# EAGLE design feelerBox1 (EAGLE 7.2.0)
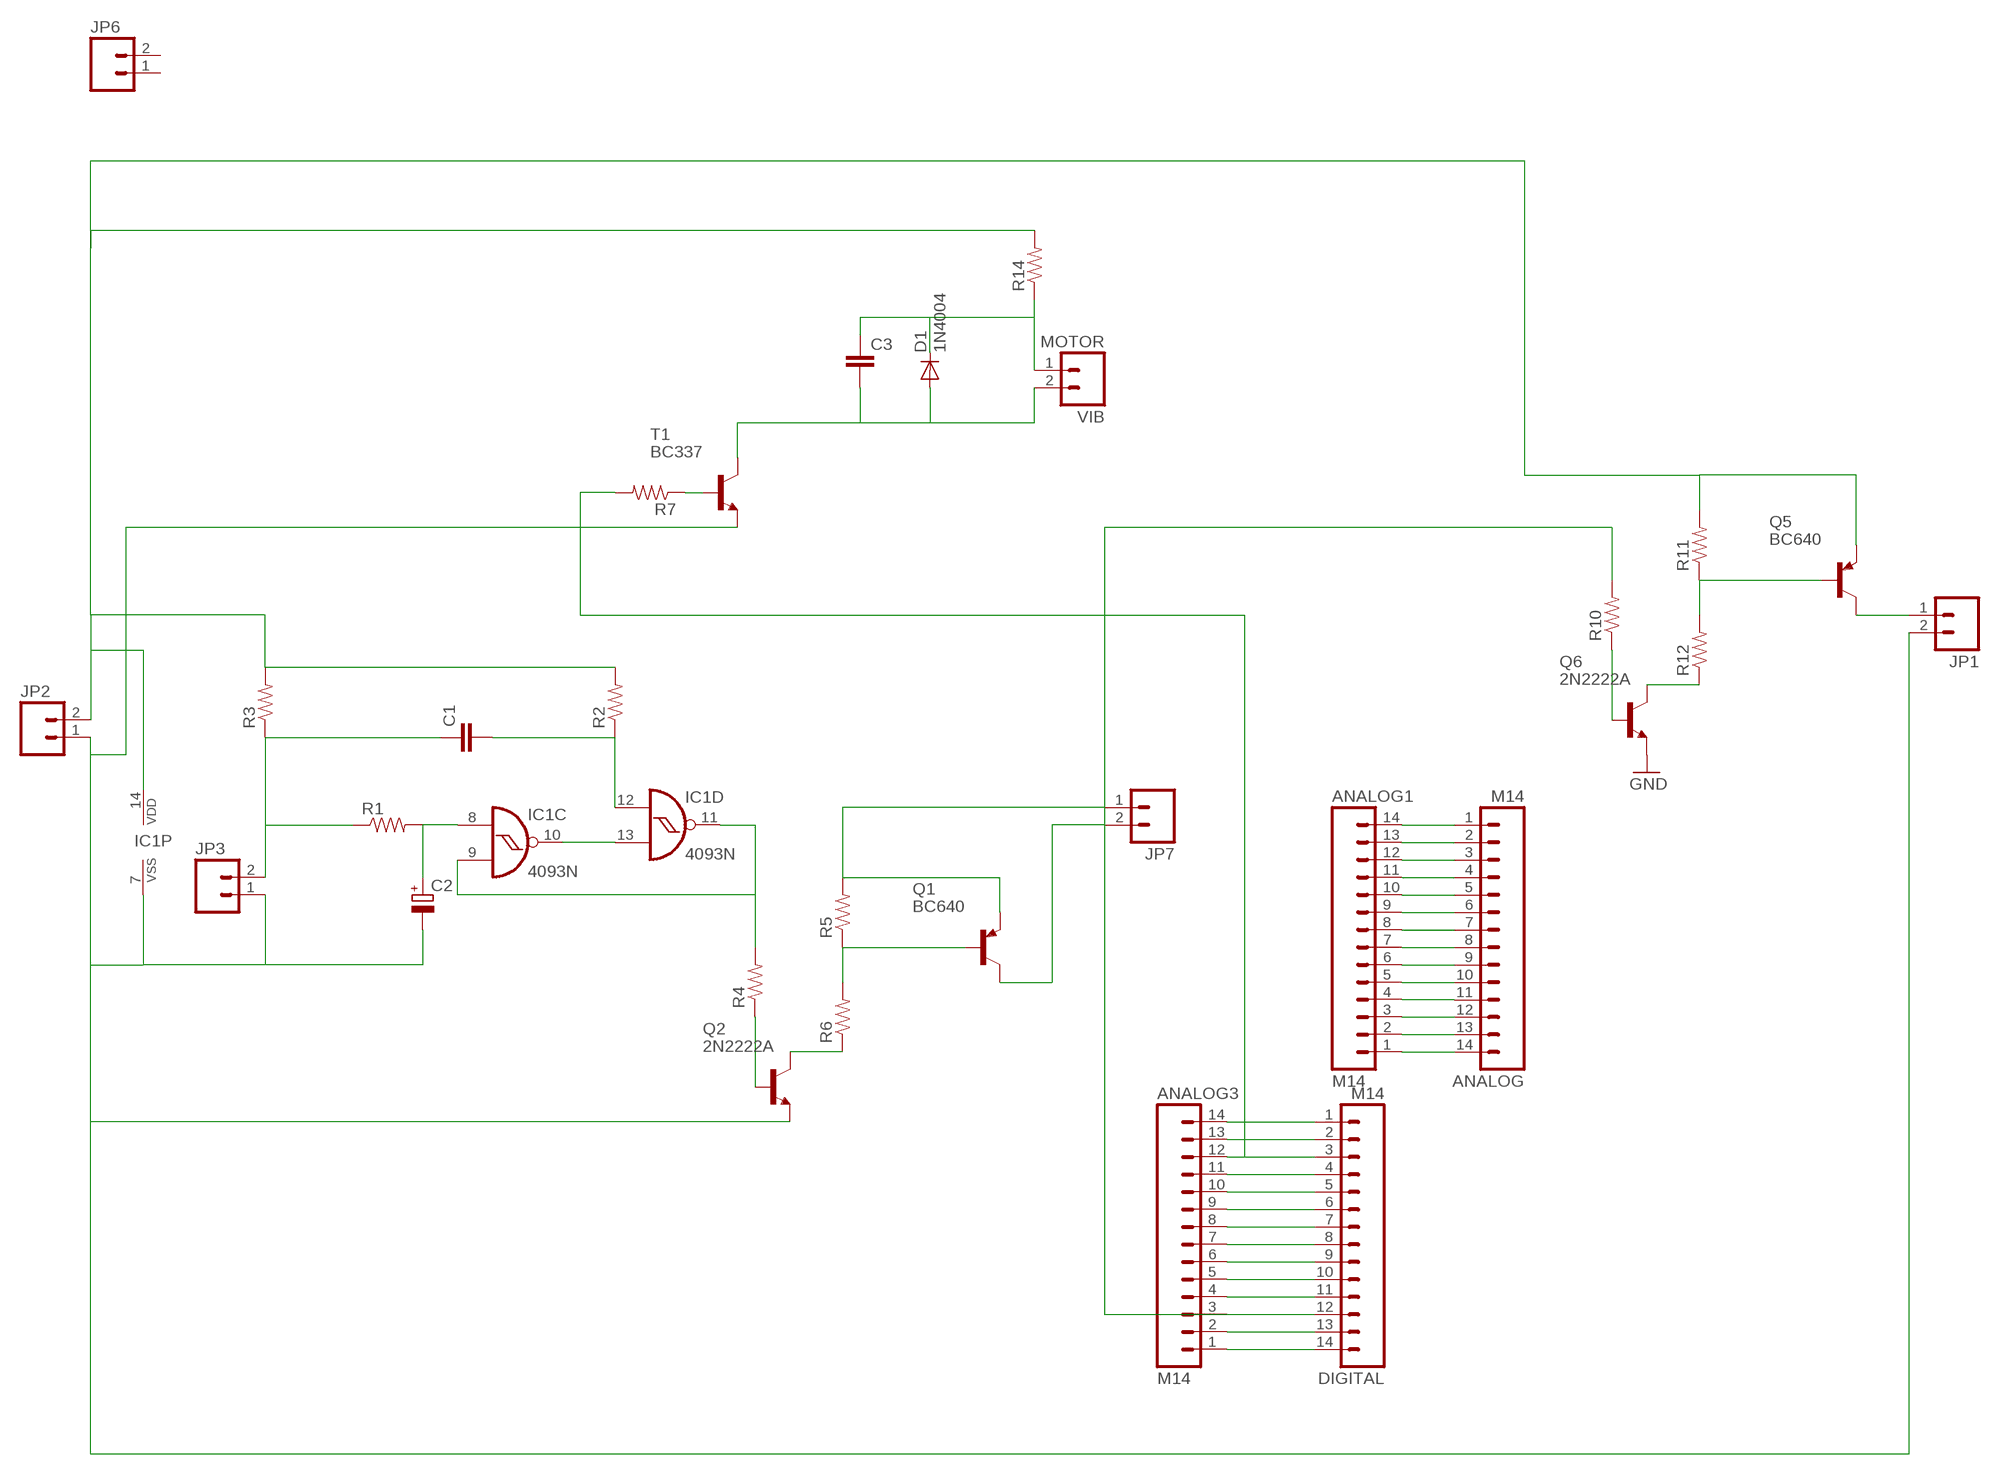
[diagram p0: schematic, sheet 1]

## Parts
ANALOG  M14  [1X14]
ANALOG1  M14  [1X14]
ANALOG3  M14  [1X14]
C1  0.1UF-50V-20%(PTH)KIT-EZ  [CAP-PTH-SMALL-KIT]
C2  CPOL-EUE2.5-5  [E2,5-5]
C3  CAPKIT  [CAP-PTH-SMALL-KIT]
D1  1N4004  [DO41-10]
DIGITAL  M14  [1X14]
IC1  4093N  [DIL14]
JP1  M02PTH  [1X02]
JP2  M02PTH  [1X02]
JP3  M02PTH  [1X02]
JP6  M02PTH  [1X02]
JP7  M02PTH  [1X02]
Q1  BC640  [TO92-BCE]
Q2  2N2222A  [TO18]
Q5  BC640  [TO92-BCE]
Q6  2N2222A  [TO18]
R1  RESISTORAXIAL-0.3  [AXIAL-0.3]
R2  RESISTORAXIAL-0.3  [AXIAL-0.3]
R3  RESISTORAXIAL-0.3  [AXIAL-0.3]
R4  RESISTORPTH-1/4W-VERT  [AXIAL-0.1]
R5  RESISTORPTH-1/4W-VERT  [AXIAL-0.1]
R6  RESISTORPTH-1/4W-VERT  [AXIAL-0.1]
R7  RESISTORAXIAL-0.3  [AXIAL-0.3]
R10  RESISTORPTH-1/4W-VERT  [AXIAL-0.1]
R11  RESISTORPTH-1/4W-VERT  [AXIAL-0.1]
R12  RESISTORPTH-1/4W-VERT  [AXIAL-0.1]
R14  RESISTORPTH-1/4W-VERT  [AXIAL-0.1]
T1  BC337  [TO92]
VIB  MOTOR  M02PTH  [1X02]

## Nets
A1: IC1.9(C:I1) IC1.11(D:O) R4.P$2
A2: ANALOG1.6 ANALOG.9
A3: ANALOG1.5 ANALOG.10
A4: ANALOG1.4 ANALOG.11
A5: ANALOG1.3 ANALOG.12
A6: ANALOG1.2 ANALOG.13
A7: ANALOG1.1 ANALOG.14
A8: ANALOG3.4 DIGITAL.11
A9: ANALOG3.3 DIGITAL.12 R10.P$2
BATTERYGND: C2.- IC1.7(P:VSS) JP1.2 JP2.1 JP3.1 Q2.1(E) T1.1(E)
BATTERYPWR: IC1.14(P:VDD) JP2.2 Q5.E R2.P$2 R3.P$2 R11.P$2 R14.P$2
D2: ANALOG3.12 DIGITAL.3 R7.P$2
D4: ANALOG3.10 DIGITAL.5
D6: ANALOG3.8 DIGITAL.7
D7: ANALOG3.7 DIGITAL.8
D8: ANALOG3.6 DIGITAL.9
D9: ANALOG3.5 DIGITAL.10
GND: ANALOG3.13 DIGITAL.2 Q6.1(E)
GND2: ANALOG3.14 DIGITAL.1
N$1: IC1.10(C:O) IC1.13(D:I1)
N$2: Q1.B R5.P$1 R6.P$2
N$3: C2.+ IC1.8(C:I0) R1.P$2
N$5: ANALOG1.9 ANALOG.6
N$6: C1.1 JP3.2 R1.P$1 R3.P$1
N$7: C1.2 IC1.12(D:I0) R2.P$1
N$8: Q2.3(C) R6.P$1
N$9: JP7.2 Q1.C
N$10: Q2.2(B) R4.P$1
N$11: JP7.1 Q1.E R5.P$2
N$12: ANALOG1.14 ANALOG.1
N$13: ANALOG1.13 ANALOG.2
N$14: ANALOG1.12 ANALOG.3
N$15: ANALOG1.11 ANALOG.4
N$16: ANALOG1.10 ANALOG.5
N$17: R7.P$1 T1.2(B)
N$18: ANALOG1.8 ANALOG.7
N$19: ANALOG1.7 ANALOG.8
N$24: Q5.B R11.P$1 R12.P$2
N$26: ANALOG3.1 DIGITAL.14
N$27: ANALOG3.2 DIGITAL.13
N$29: ANALOG3.9 DIGITAL.6
N$30: ANALOG3.11 DIGITAL.4
N$36: Q6.3(C) R12.P$1
N$37: C3.2 D1.A T1.3(C) VIB.2
N$38: C3.1 D1.C R14.P$1 VIB.1
N$39: Q6.2(B) R10.P$1
N$41: JP1.1 Q5.C
Unconnected: IC1.1(A:I0) IC1.2(A:I1) IC1.3(A:O) IC1.4(B:O) IC1.5(B:I0) IC1.6(B:I1) JP6.1 JP6.2

## Library data of the parts
ANALOG ANALOG1 ANALOG3 DIGITAL = SparkFun:M14: Header 14 Standard 14-pin 0.1" header. Use with straight break away headers (SKU : PRT-00116), right angle break away headers (PRT-00553), swiss pins (PRT-00743), machine pins (PRT-00117), and female headers (PRT-00115).
C1 = SparkFun-Capacitors:0.1UF-50V-20%(PTH): CAP-08370; PROD_ID: CAP-08370
C2 = rcl:CPOL-EU: POLARIZED CAPACITOR, European symbol
C3 = SparkFun-Capacitors:CAP: Capacitor Standard 0603 ceramic capacitor, and 0.1" leaded capacitor.
D1 = diode:1N4004: DIODE general purpose rectifier, 1 A
IC1 = 40xx:4093: Quad 2-input NAND schmitt trigger
JP1-JP3 JP6 JP7 VIB = SparkFun:M02: Header 2 Standard 2-pin 0.1" header. Use with straight break away headers (SKU : PRT-00116), right angle break away headers (PRT-00553), swiss pins (PRT-00743), machine pins (PRT-00117), and female headers (PRT-00115). Molex polarized connector foot print use with SKU : PRT-08233 with associated crimp pins and housings.
Q1 Q5 = transistor-pnp:BC640*: PNP Transistror
Q2 Q6 = transistor-npn:2N2222*: NPN Transistor
R1-R7 R10-R12 R14 = SparkFun-Resistors:RESISTOR: Resistor Basic schematic elements and footprints for 0603, 1206, and PTH resistors.
T1 = transistor:BC337: NPN TRANSISTOR

## Net classes
0 Default: width 0.203 mm
1 VCC: width 0.381 mm
2 LEDPower: width 0.203 mm
3 ButtonSignal: width 0.203 mm

## Board
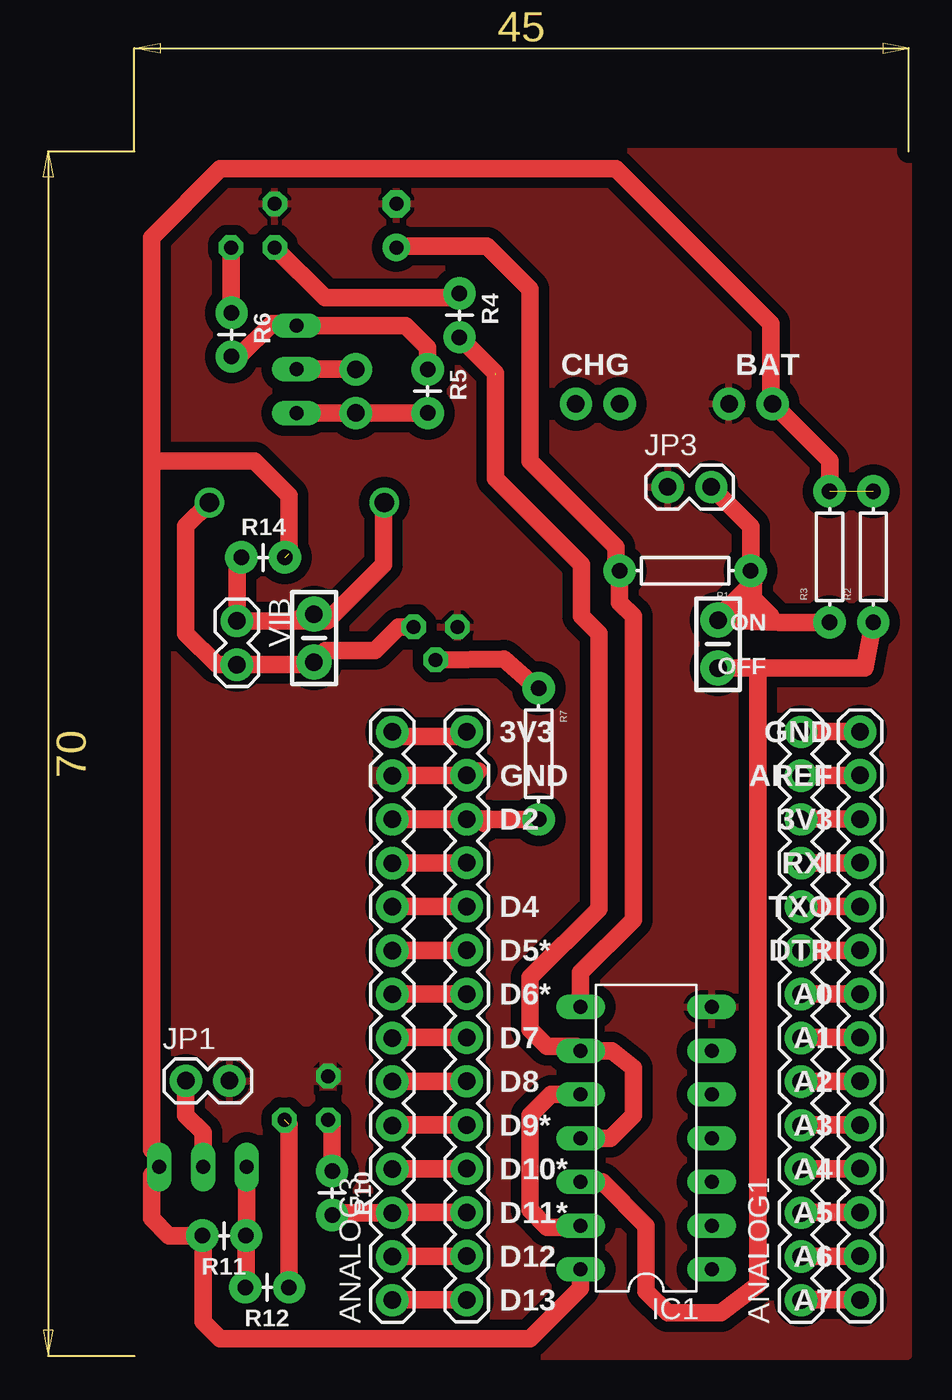
[diagram p1: board, top side]
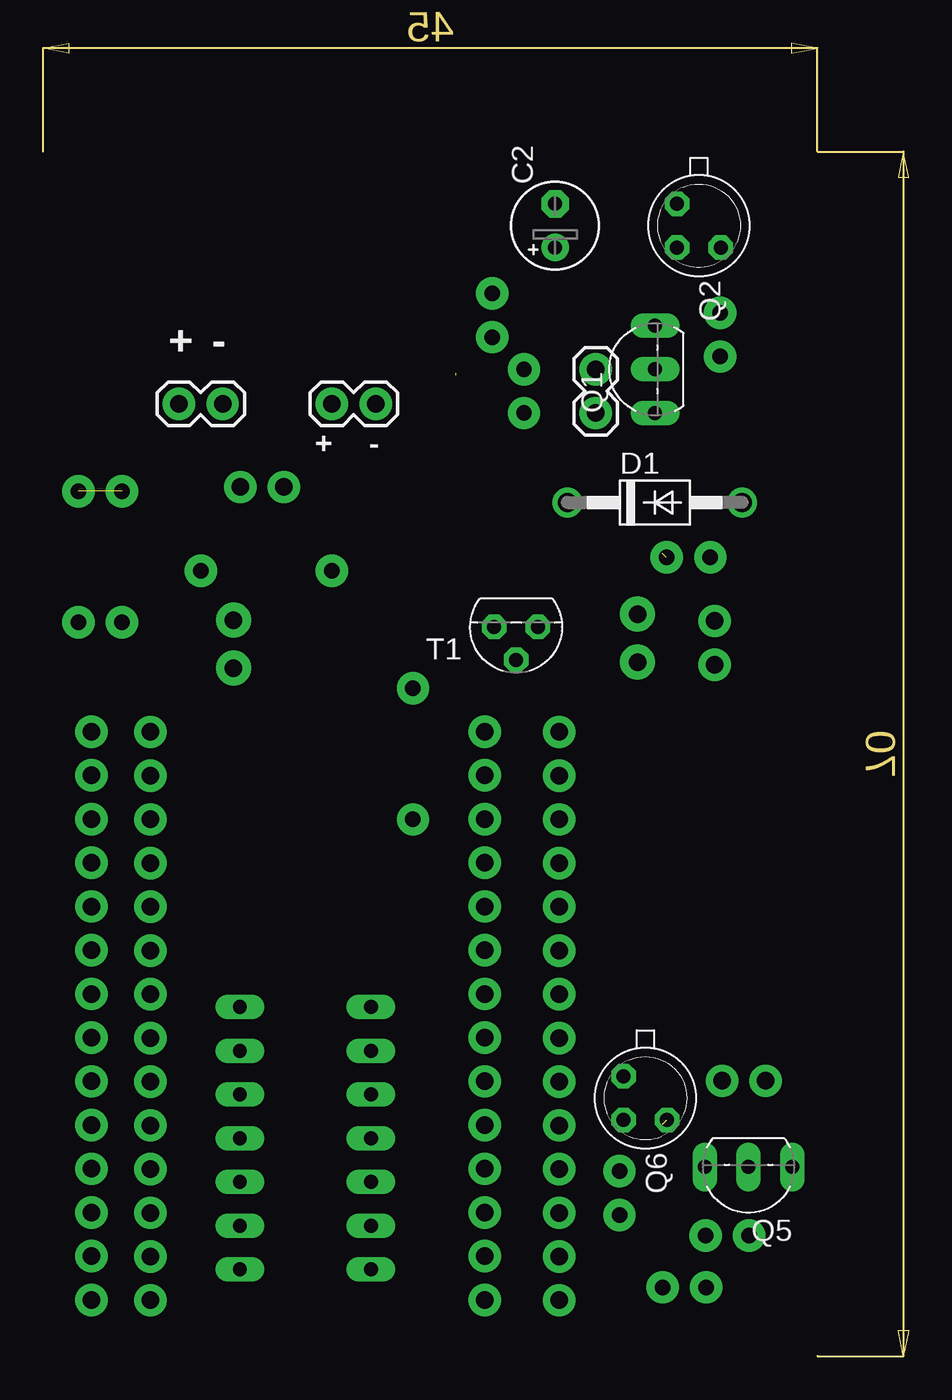
[diagram p2: board, bottom side, seen from below]

Size 50.3 x 76.3 mm. Coordinates in mm from the lower left corner, seen from the top.
Copper layers (1*16): Top 0.035mm / dielectric 1.5mm / Bottom 0.035mm
Design rules "SparkFun *": minimum track width 8mil, minimum drill 20mil, track to track 8mil, track to pad 8mil, pad to pad 8mil, via to via 8mil, smd to smd 8mil, copper to edge 10mil, drill to drill 8mil, minimum pad ring 12mil, minimum via ring 10mil, stop-mask expansion 4mil, vias tented up to drill 25mil, thermal gap 10mil

### Footprints (pad centres in the part's own frame; a part is rotated, then mirrored left to right if it is on the bottom)
1X14 = drill 1.016 pad 1.88: 1 0,0; 2 2.54,0; 3 5.08,0; 4 7.62,0; 5 10.16,0; 6 12.7,0; 7 15.24,0; 8 17.78,0; 9 20.32,0; 10 22.86,0; 11 25.4,0; 12 27.94,0; 13 30.48,0; 14 33.02,0
CAP-PTH-SMALL-KIT = drill 1.016 pad 2.032: 1 -1.397,0; 2 1.397,0
E2,5-5 = drill 0.813 pad 1.6: + -1.27,0 | drill 0.813 pad 1.6 octagon: - 1.27,0
DO41-10 = drill 1.118: A 5.08,0; C -5.08,0
DIL14 = drill 0.813 long: 1 -7.62,-3.81; 2 -5.08,-3.81; 3 -2.54,-3.81; 4 0,-3.81; 5 2.54,-3.81; 6 5.08,-3.81; 7 7.62,-3.81; 8 7.62,3.81; 9 5.08,3.81; 10 2.54,3.81; 11 0,3.81; 12 -2.54,3.81; 13 -5.08,3.81; 14 -7.62,3.81
1X02 = drill 1.016 pad 1.88: 1 0,0; 2 2.54,0
TO92-BCE = drill 0.813 long: B 2.54,0; C 0,0; E -2.54,0
TO18 = drill 0.813 octagon: 1 -1.27,-1.27; 2 1.27,-1.27; 3 1.27,1.27
AXIAL-0.3 = drill 0.9 pad 1.88: P$1 -3.81,0; P$2 3.81,0
AXIAL-0.1 = drill 0.9 pad 1.88: P$1 0,0; P$2 2.54,0
TO92 = drill 0.813 octagon: 1 1.27,0; 2 0,1.905; 3 -1.27,0

### Placement (x,y rotation side)
ANALOG  47.48,36.29 270 top
ANALOG1  44.05,3.25 90 top
ANALOG3  20.3,3.25 90 top
C1  39.22,41.37 270 top
C2  20.54,65.69 90 bottom
C3  15.75,41.72 270 top
D1  14.75,49.6 0 bottom
DIGITAL  24.62,36.29 270 top
IC1  35.05,12.67 90 top
JP1  8.3,16 0 top
JP2  39.86,55.34 180 bottom
JP3  36.3,50.5 0 top
JP6  30.97,55.34 180 bottom
JP7  18.18,54.8 90 bottom
Q1  14.73,57.34 90 bottom
Q2  12.19,65.69 270 bottom
Q5  9.3,11 180 bottom
Q6  15.3,15 270 bottom
R1  37.32,45.64 180 top
R2  48.25,46.45 90 top
R3  45.71,46.45 90 top
R4  24.2,61.75 270 top
R5  22.35,57.34 270 top
R6  10.96,60.62 270 top
R7  28.8,35 270 top
R10  16.8,10.75 270 top
R11  11.8,7 180 top
R12  14.3,4 180 top
R14  11.52,46.41 0 top
T1  22.81,42.37 180 bottom
VIB  11.27,42.72 270 top

### Tracks (layer width: path | path; a pad name or v marks a point on that pad's centre or on a via)
A1  (1 unrouted)
  Top 1.016: R4.P$2 26.3,57.11 | IC1.11 32.97,12.67 34.3,14 34.3,16.75 33.05,17.75 IC1.9 30.99,18 29.3,18 28.3,19 28.3,22 32.3,26 32.3,42 31.3,43 31.3,46 26.3,51 26.3,57
A2
  Top 1.016: ANALOG1.6 44.07,15.97 ANALOG.9
A3
  Top 1.016: ANALOG1.5 44.07,13.43 ANALOG.10
A4
  Top 1.016: ANALOG1.4 44.07,10.89 ANALOG.11
A5
  Top 1.016: ANALOG1.3 44.07,8.35 ANALOG.12
A6
  Top 1.016: ANALOG1.2 44.07,5.81 ANALOG.13
A7
  Top 1.016: ANALOG1.1 44.07,3.27 ANALOG.14
A8
  Top 1.016: ANALOG3.4 20.32,10.89 DIGITAL.11
A9
  Top 1.016: R10.P$2 16.92,8.33 ANALOG3.3 20.32,8.35 DIGITAL.12
BATTERYGND
  Top 0.813: JP2.1 39.52,55
  Top 1.016: C2.- 20.58,67 | 38.01,20.29 IC1.7
  pour Top (isolate 0.61): 5.3,0 50.3,0 50.3,70 5.3,70
BATTERYPWR  (2 unrouted)
  Top 1.016: R3.P$2 45.71,52.03 JP2.2 42.3,55.44 42.3,60 33.3,69 10.3,69 6.3,65 6.3,52 | 6.3,52 6.3,12 6.76,11.54 Q5.E 6.3,10.54 6.3,8 7.3,7 R11.P$2 9.3,6.96 9.3,2 10.3,1 28.3,1 31.24,3.94 IC1.14 | 14.3,46.65 14.3,50 12.3,52 6.3,52
D2
  Top 1.016: 25.62,30.94 25.89,31.21 DIGITAL.3 20.32,31.21 ANALOG3.12 R7.P$2
D4
  Top 1.016: ANALOG3.10 20.32,26.13 DIGITAL.5
D6
  Top 1.016: ANALOG3.8 20.32,21.05 DIGITAL.7
D7
  Top 1.016: ANALOG3.7 20.32,18.51 DIGITAL.8
D8
  Top 1.016: 24.35,15.7 DIGITAL.9 20.32,15.97 ANALOG3.6
D9
  Top 1.016: 24.35,13.16 DIGITAL.10 20.32,13.43 ANALOG3.5
GND
  Top 1.016: 24.35,33.48 DIGITAL.2 20.32,33.75 ANALOG3.13
  pour Top (isolate 1): 6.3,1 6.3,38 20.3,38 20.3,1
GND2
  Top 1.016: 24.35,36.02 DIGITAL.1 24.59,36.29 24.3,36 20.57,36 ANALOG3.14
N$1
  Top 1.016: IC1.13 31.15,7.5 29.3,7.5 28.3,8.5 28.3,14 29.51,15.21 IC1.10
N$2
  Top 1.016: R5.P$1 22.35,58.61 21.08,59.88 Q1.B 14.61,60 13.3,60 11.38,58.08 R6.P$2
N$3
  Top 1.016: C2.+ 20.62,64.5 25.8,64.5 28.3,62 28.3,52 33.3,47 33.3,45.85 R1.P$2 33.51,43.79 34.3,43 34.3,25.35 31.24,22.29 IC1.8
N$4
  Top 1.016: 41.3,45 40.3,44 | 40.3,44 40.3,43 | 40.3,44 39.3,43
N$5
  Top 1.016: ANALOG1.9 44.07,23.59 ANALOG.6
N$6
  Top 1.016: C1.1 41.29,42.69 | 41.29,42.69 42.8,42.64 R3.P$1 | R1.P$1 41.29,45.48 41.29,42.69 | 41.13,46.21 R1.P$1 | JP3.2 41.13,48.21 R1.P$1
N$7
  Top 1.016: IC1.12 32.51,10.13 35.05,7.59 35.05,3.78 36.32,2.51 39.4,2.51 41.55,4.16 41.55,39.97 | R2.P$1 47.75,39.97 41.55,39.97 | 41.55,39.97 C1.2
N$8
  Top 1.016: R6.P$1 10.92,61.66 Q2.3
N$9
  Top 1.016: JP7.2 Q1.C
N$10
  Top 1.016: Q2.2 16.38,61.5 23.8,61.5 24.05,61.75 R4.P$1
N$11
  Top 1.016: R5.P$2 JP7.1 Q1.E
N$12
  Top 1.016: ANALOG1.14 44.07,36.29 ANALOG.1
N$13
  Top 1.016: ANALOG1.13 44.07,33.75 ANALOG.2
N$14
  Top 1.016: ANALOG1.12 44.07,31.21 ANALOG.3
N$15
  Top 1.016: ANALOG1.11 44.07,28.67 ANALOG.4
N$16
  Top 1.016: ANALOG1.10 44.07,26.13 ANALOG.5
N$17
  Top 1.016: R7.P$1 28.49,39 26.8,40.5 22.77,40.47 T1.2
N$18
  Top 1.016: ANALOG1.8 44.07,21.05 ANALOG.7
N$19
  Top 1.016: ANALOG1.7 44.07,18.51 ANALOG.8
N$21
  Top 1.016: 42.3,43 41.3,44
N$24
  Top 1.016: R12.P$2 11.8,4.04 R11.P$1 11.84,7.04 Q5.B
N$25
  Top 1.016: 25.3,34 24.8,33.5
N$26
  Top 1.016: 24.35,3 DIGITAL.14 20.32,3.27 ANALOG3.1
N$27
  Top 1.016: 24.35,5.54 DIGITAL.13 20.32,5.81 ANALOG3.2
N$29
  Top 1.016: ANALOG3.9 20.32,23.59 DIGITAL.6
N$30
  Top 1.016: 24.35,28.4 DIGITAL.4 20.32,28.67 ANALOG3.11
N$36  (1 unrouted)
  Top 1.016: 14.3,13.46 R12.P$1
N$37
  Top 1.016: D1.A 8.3,48.23 8.3,42 10.12,40.18 VIB.2 15.61,40.18 C3.2 16.43,41 19.3,41 20.67,42.37 T1.3
N$38
  Top 1.016: R14.P$1 11.27,45.66 VIB.1 14.35,42.72 | C3.1 14.35,42.72 | D1.C 19.8,49.57 19.8,46 16.52,42.72 14.35,42.72
N$39
  Top 1.016: Q6.2 16.8,13.5 R10.P$1
N$41
  Top 1.016: Q5.C 9.3,13 8.3,14 JP1.1

### Text on the board
tPlace: CHG | BAT | ON | OFF | GND | 3V3 | AREF | GND | 3V3 | D2 | RXI | TXO | D4 | DTR | D5* | A0 | D6* | A1 | D7 | A2 | D8 | A3 | D9* | A4 | D10* | A5 | D11* | A6 | D12 | A7 | D13
bPlace: - | + | - | +